# Altium schematic sheet MCU.SchDoc: STM32 microcontroller IOs
size 420 x 297 mm; CompanyName: STMicroelectronics; Organization: Microcontrollers Division; DocumentNumber: 16; SheetNumber: 17; SheetTotal: 17
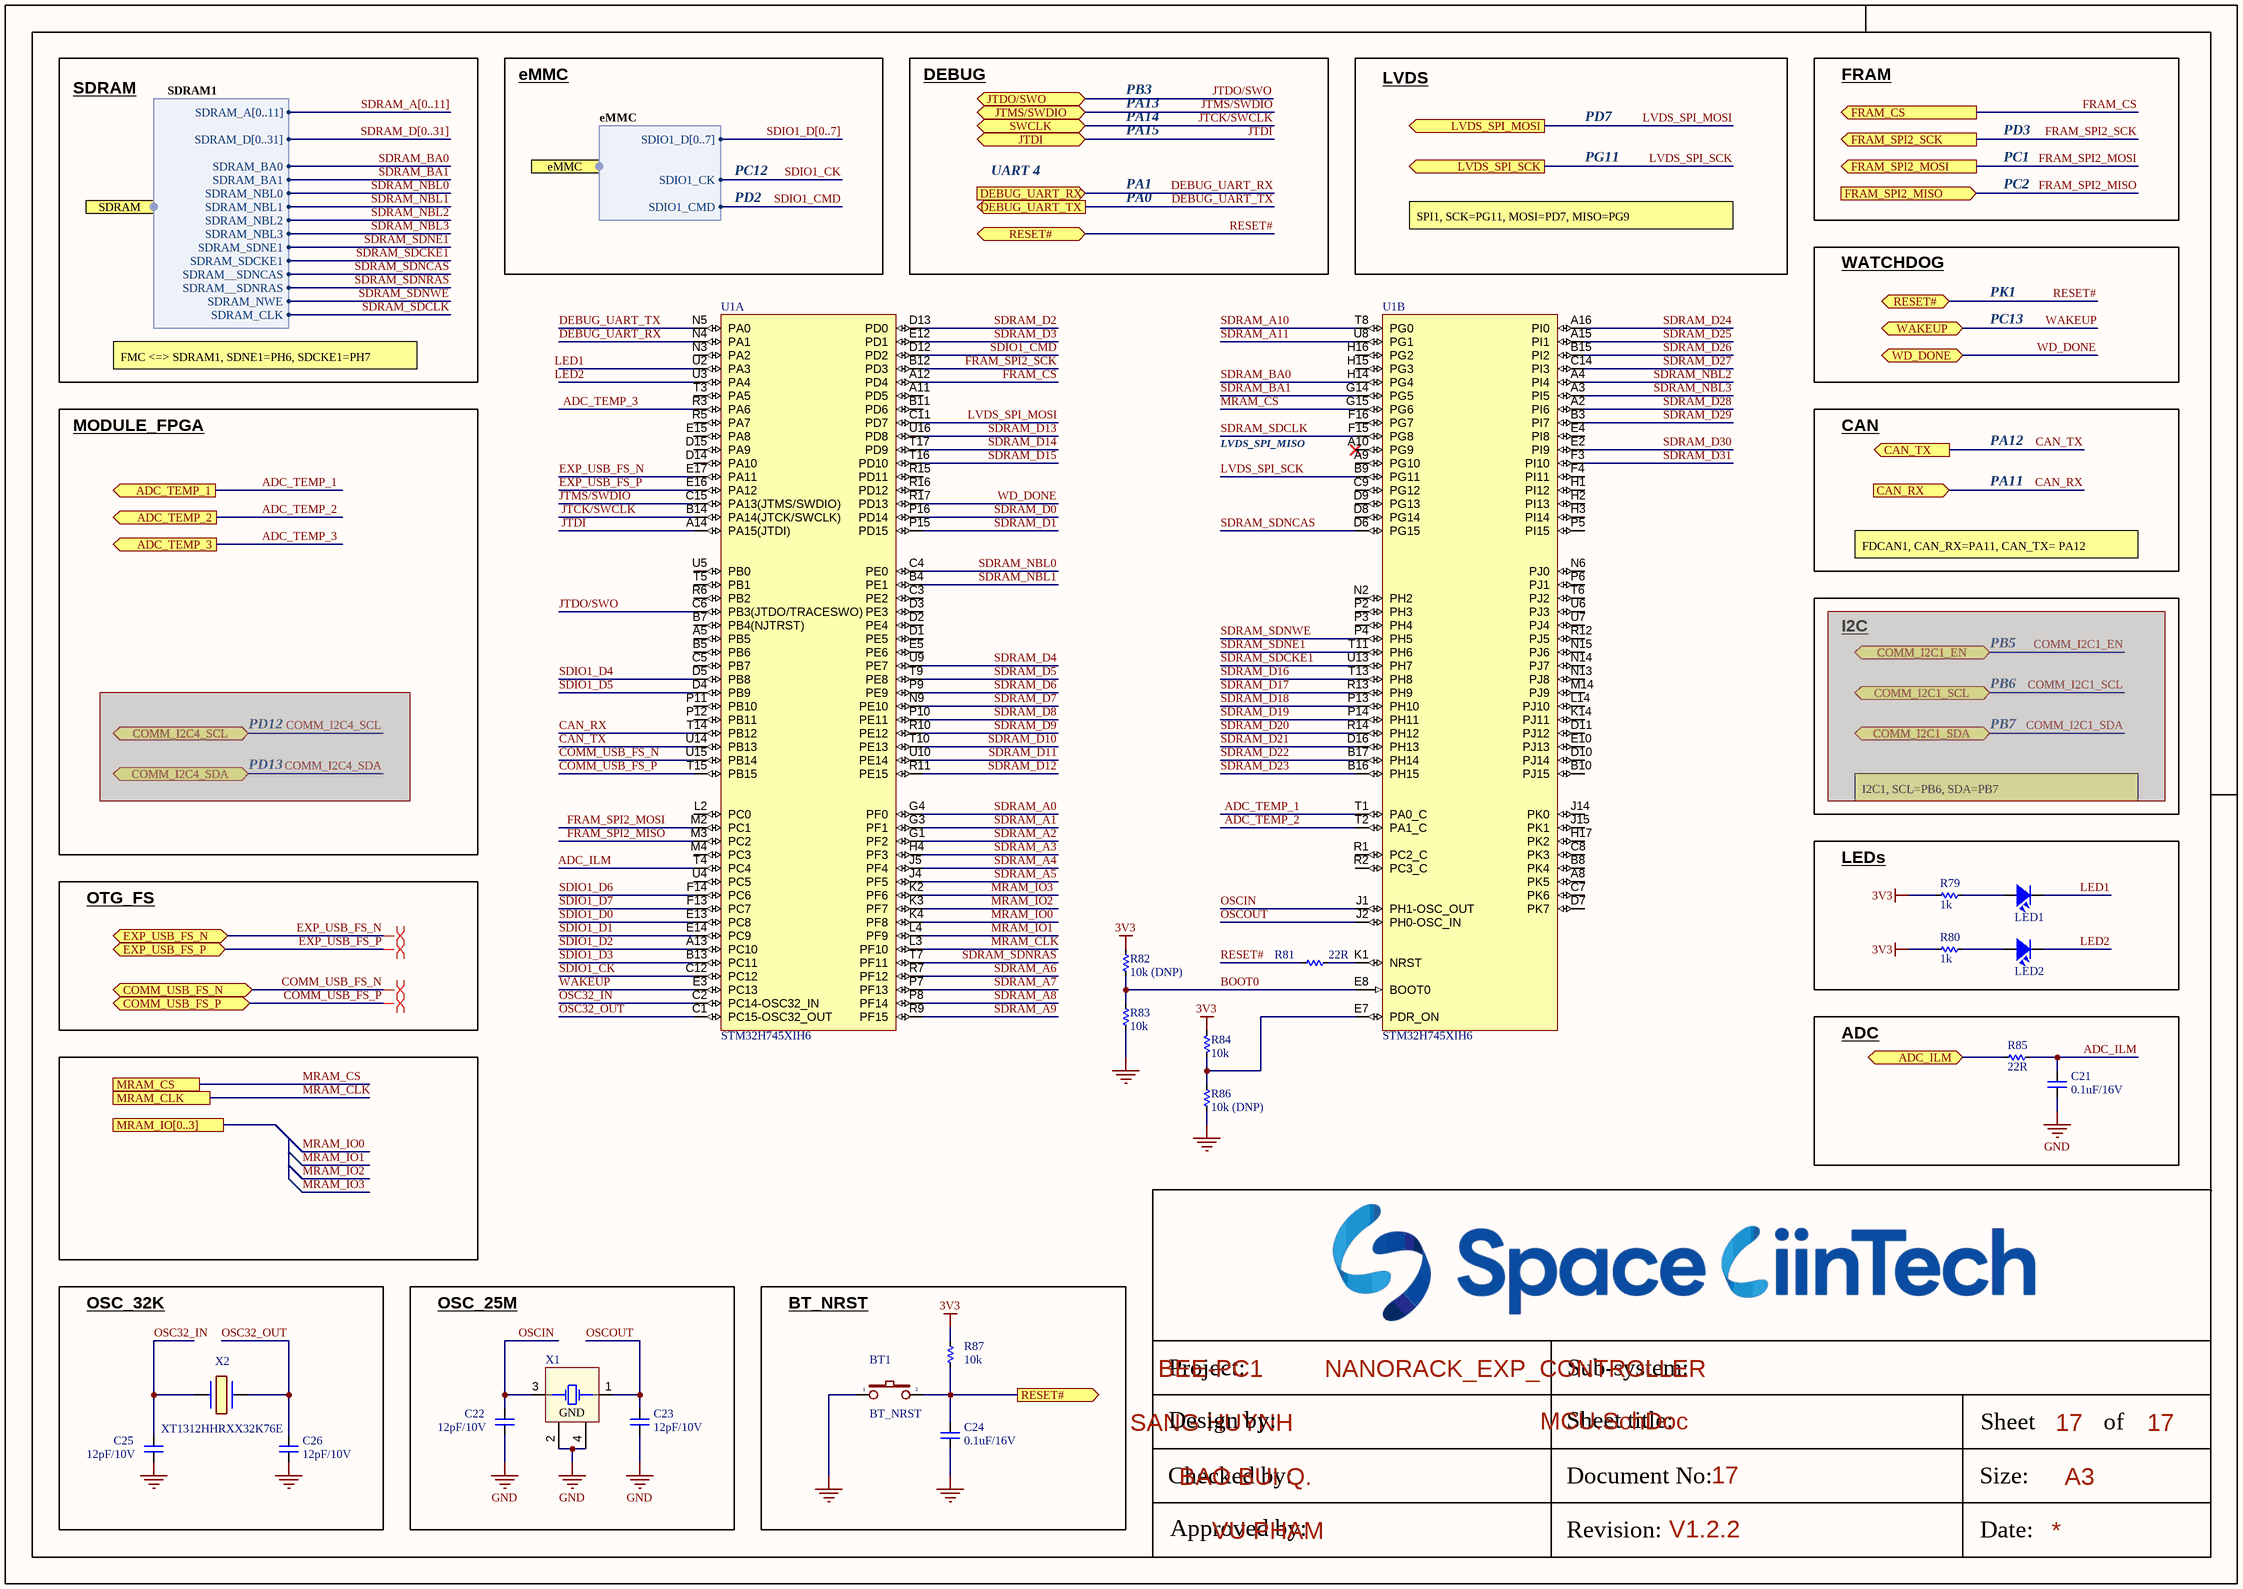
[diagram p0: MCU.SchDoc]

## Parts
BT1  BT_NRST  [SW2-SMD]
C21  0.1uF/16V  [CAP_C_1608X80]
C22  12pF/10V  [CAP_C_1608X80]
C23  12pF/10V  [CAP_C_1608X80]
C24  0.1uF/16V  [CAP_C_1608X80]
C25  12pF/10V  [CAP_C_1608X80]
C26  12pF/10V  [CAP_C_1608X80]
LED1  150060BS75000  [LED_0603]  (value not drawn)
LED2  150060GS75000  [LED_0603]  (value not drawn)
R79  1k  [RES_C_1608X60]
R80  1k  [RES_C_1608X60]
R81  22R  [RES_C_1608X60]
R82  10k (DNP)  [RES_C_1608X60]
R83  10k  [RES_C_1608X60]
R84  10k  [RES_C_1608X60]
R85  22R  [RES_C_1608X60]
R86  10k (DNP)  [RES_C_1608X60]
R87  10k  [RES_C_1608X60]
U1  STM32H745XIH6  [BGA265C80P17X17_1400X1400X110N]  (parts A,B of 3)
X1  ECS-250-12-33Q-JES-TR  [XTAL_ECS-250-12-33Q-JES-TR]  (value not drawn)
X2  XT1312HHRXX32K76E  [XT1312HHRXX32K76E]

## Blocks framed on the sheet
LEDs: LED1 LED2 R79 R80
ADC: C21 R85
OSC_32K: C25 C26 X2
OSC_25M: C22 C23 X1
BT_NRST: BT1 C24 R87

## Ports
ADC_ILM (bidir), ADC_TEMP_1 (out), ADC_TEMP_2 (out), ADC_TEMP_3 (out), CAN_RX (in), CAN_TX (out), COMM_I2C1_EN (bidir), COMM_I2C1_SCL (bidir), COMM_I2C1_SDA (bidir), COMM_I2C4_SCL (bidir), COMM_I2C4_SDA (bidir), COMM_USB_FS_N (bidir), COMM_USB_FS_P (bidir), DEBUG_UART_RX (in), DEBUG_UART_TX (out), eMMC (harness eMMC), EXP_USB_FS_N (bidir), EXP_USB_FS_P (bidir), FRAM_CS (out), FRAM_SPI2_MISO (in), FRAM_SPI2_MOSI (out), FRAM_SPI2_SCK (out), JTDI (bidir), JTDO/SWO (bidir), JTMS/SWDIO (bidir), LVDS_SPI_MOSI (out), LVDS_SPI_SCK (out), MRAM_CLK, MRAM_CS, MRAM_IO[0..3], RESET# (bidir), RESET# (out), SDRAM (harness SDRAM1), SWCLK (bidir), WAKEUP (bidir), WD_DONE (bidir)

## Harnesses
SDRAM1: SDRAM_A[0..11], SDRAM__SDNCAS, SDRAM_NBL0, SDRAM_SDNE1, SDRAM_SDCKE1, SDRAM_D[0..31], SDRAM_NBL1, SDRAM_BA0, SDRAM_BA1, SDRAM_NWE, SDRAM_CLK, SDRAM__SDNRAS, SDRAM_NBL3, SDRAM_NBL2
eMMC: SDIO1_D[0..7], SDIO1_CMD, SDIO1_CK

## Nets
3V3: R79.1 R80.1 R82.1 R84.1 R87.1
GND: BT1.1 C21.1 C22.1 C23.1 C24.1 C25.1 C26.1 R83.2 R86.2 X1.2(GND) X1.4(GND)
ADC_ILM: R85.1 ; port ADC_ILM
ADC_ILM: C21.2 R85.2 U1.T4(PC4)  [a separate net that carries the same name]
ADC_TEMP_1: U1.T1(PA0_C) ; port ADC_TEMP_1
ADC_TEMP_2: U1.T2(PA1_C) ; port ADC_TEMP_2
ADC_TEMP_3: U1.R3(PA6) ; port ADC_TEMP_3
BOOT0: R82.2 R83.1 U1.E8(BOOT0)
CAN_RX: U1.T14(PB12) ; port CAN_RX
CAN_TX: U1.U14(PB13) ; port CAN_TX
COMM_USB_FS_N: U1.U15(PB14) ; port COMM_USB_FS_N
COMM_USB_FS_P: U1.T15(PB15) ; port COMM_USB_FS_P
DEBUG_UART_RX: U1.N4(PA1) ; port DEBUG_UART_RX
DEBUG_UART_TX: U1.N5(PA0) ; port DEBUG_UART_TX
EXP_USB_FS_N: U1.E17(PA11) ; port EXP_USB_FS_N
EXP_USB_FS_P: U1.E16(PA12) ; port EXP_USB_FS_P
FRAM_CS: U1.A12(PD4) ; port FRAM_CS
FRAM_SPI2_MISO: U1.M3(PC2) ; port FRAM_SPI2_MISO
FRAM_SPI2_MOSI: U1.M2(PC1) ; port FRAM_SPI2_MOSI
FRAM_SPI2_SCK: U1.B12(PD3) ; port FRAM_SPI2_SCK
JTCK/SWCLK: U1.B14(PA14(JTCK/SWCLK)) ; port SWCLK
JTDI: U1.A14(PA15(JTDI)) ; port JTDI
JTDO/SWO: U1.C6(PB3(JTDO/TRACESWO)) ; port JTDO/SWO
JTMS/SWDIO: U1.C15(PA13(JTMS/SWDIO)) ; port JTMS/SWDIO
LED1: LED1.2 U1.U2(PA3)
LED2: LED2.2 U1.U3(PA4)
LVDS_SPI_MOSI: U1.C11(PD7) ; port LVDS_SPI_MOSI
LVDS_SPI_SCK: U1.B9(PG11) ; port LVDS_SPI_SCK
MRAM_CLK: U1.L3(PF10) ; port MRAM_CLK
MRAM_CS: U1.G15(PG6) ; port MRAM_CS
MRAM_IO0: U1.K4(PF8)
MRAM_IO1: U1.L4(PF9)
MRAM_IO2: U1.K3(PF7)
MRAM_IO3: U1.K2(PF6)
OSC32_IN: C25.2 U1.C2(PC14-OSC32_IN) X2.1
OSC32_OUT: C26.2 U1.C1(PC15-OSC32_OUT) X2.2
OSCIN: C22.2 U1.J1(PH1-OSC_OUT) X1.3(XTAL)
OSCOUT: C23.2 U1.J2(PH0-OSC_IN) X1.1(XTAL)
RESET#: BT1.2 C24.2 R81.1 R87.2 ; port RESET#
SDIO1_CK: U1.C12(PC12) ; port eMMC.SDIO1_CK
SDIO1_CMD: U1.D12(PD2) ; port eMMC.SDIO1_CMD
SDIO1_D0: U1.E13(PC8)
SDIO1_D1: U1.E14(PC9)
SDIO1_D2: U1.A13(PC10)
SDIO1_D3: U1.B13(PC11)
SDIO1_D4: U1.D5(PB8)
SDIO1_D5: U1.D4(PB9)
SDIO1_D6: U1.F14(PC6)
SDIO1_D7: U1.F13(PC7)
SDRAM_A0: U1.G4(PF0)
SDRAM_A1: U1.G3(PF1)
SDRAM_A2: U1.G1(PF2)
SDRAM_A3: U1.H4(PF3)
SDRAM_A4: U1.J5(PF4)
SDRAM_A5: U1.J4(PF5)
SDRAM_A6: U1.R7(PF12)
SDRAM_A7: U1.P7(PF13)
SDRAM_A8: U1.P8(PF14)
SDRAM_A9: U1.R9(PF15)
SDRAM_A10: U1.T8(PG0)
SDRAM_A11: U1.U8(PG1)
SDRAM_BA0: U1.H14(PG4) ; port SDRAM.SDRAM_BA0
SDRAM_BA1: U1.G14(PG5) ; port SDRAM.SDRAM_BA1
SDRAM_D0: U1.P16(PD14)
SDRAM_D1: U1.P15(PD15)
SDRAM_D2: U1.D13(PD0)
SDRAM_D3: U1.E12(PD1)
SDRAM_D4: U1.U9(PE7)
SDRAM_D5: U1.T9(PE8)
SDRAM_D6: U1.P9(PE9)
SDRAM_D7: U1.N9(PE10)
SDRAM_D8: U1.P10(PE11)
SDRAM_D9: U1.R10(PE12)
SDRAM_D10: U1.T10(PE13)
SDRAM_D11: U1.U10(PE14)
SDRAM_D12: U1.R11(PE15)
SDRAM_D13: U1.U16(PD8)
SDRAM_D14: U1.T17(PD9)
SDRAM_D15: U1.T16(PD10)
SDRAM_D16: U1.T13(PH8)
SDRAM_D17: U1.R13(PH9)
SDRAM_D18: U1.P13(PH10)
SDRAM_D19: U1.P14(PH11)
SDRAM_D20: U1.R14(PH12)
SDRAM_D21: U1.D16(PH13)
SDRAM_D22: U1.B17(PH14)
SDRAM_D23: U1.B16(PH15)
SDRAM_D24: U1.A16(PI0)
SDRAM_D25: U1.A15(PI1)
SDRAM_D26: U1.B15(PI2)
SDRAM_D27: U1.C14(PI3)
SDRAM_D28: U1.A2(PI6)
SDRAM_D29: U1.B3(PI7)
SDRAM_D30: U1.E2(PI9)
SDRAM_D31: U1.F3(PI10)
SDRAM_NBL0: U1.C4(PE0) ; port SDRAM.SDRAM_NBL0
SDRAM_NBL1: U1.B4(PE1) ; port SDRAM.SDRAM_NBL1
SDRAM_NBL2: U1.A4(PI4) ; port SDRAM.SDRAM_NBL2
SDRAM_NBL3: U1.A3(PI5) ; port SDRAM.SDRAM_NBL3
SDRAM_SDCKE1: U1.U13(PH7) ; port SDRAM.SDRAM_SDCKE1
SDRAM_SDCLK: U1.F15(PG8) ; port SDRAM.SDRAM_CLK
SDRAM_SDNCAS: U1.D6(PG15) ; port SDRAM.SDRAM__SDNCAS
SDRAM_SDNE1: U1.T11(PH6) ; port SDRAM.SDRAM_SDNE1
SDRAM_SDNRAS: U1.T7(PF11) ; port SDRAM.SDRAM__SDNRAS
SDRAM_SDNWE: U1.P4(PH5) ; port SDRAM.SDRAM_NWE
WAKEUP: U1.E3(PC13) ; port WAKEUP
WD_DONE: U1.R17(PD13) ; port WD_DONE
NetLED1_1: LED1.1 R79.2
NetLED2_1: LED2.1 R80.2
NetR81_2: R81.2 U1.K1(NRST)
NetR84_2: R84.2 R86.1 U1.E7(PDR_ON)

Not connected (* = marked no-connect by the designer): U1 A5(PB5) A8(PK5) A9(PG10) A10(PG9)* A11(PD5) B5(PB6) B7(PB4(NJTRST)) B8(PK4) B10(PJ15) B11(PD6) C3(PE2) C5(PB7) C7(PK6) C8(PK3) C9(PG12) D1(PE5) D2(PE4) D3(PE3) D7(PK7) D8(PG14) D9(PG13) D10(PJ14) D11(PJ12) D14(PA10) D15(PA9) E4(PI8) E5(PE6) E10(PJ13) E15(PA8) F4(PI11) F16(PG7) H1(PI12) H2(PI13) H3(PI14) H15(PG3) H16(PG2) H17(PK2) J14(PK0) J15(PK1) K14(PJ11) L2(PC0) L14(PJ10) M4(PC3) M14(PJ9) N2(PH2) N3(PA2) N6(PJ0) N13(PJ8) N14(PJ7) N15(PJ6) P2(PH3) P3(PH4) P5(PI15) P6(PJ1) P11(PB10) P12(PB11) R1(PC2_C) R2(PC3_C) R5(PA7) R6(PB2) R12(PJ5) R15(PD11) R16(PD12) T3(PA5) T5(PB1) T6(PJ2) U4(PC5) U5(PB0) U6(PJ3) U7(PJ4)

## Buses and harness runs
bus SDIO1_D[0..7]
bus SDRAM_A[0..11]
bus SDRAM_D[0..31]

## Layout directives
differential pair: COMM_USB_FS_N, COMM_USB_FS_P, EXP_USB_FS_N, EXP_USB_FS_P

## Notes on the sheet
- SDRAM
- eMMC
- DEBUG
- PB3
- PA13
- PA14
- LVDS
- PD7
- FRAM
- PC12
- UART 4
- PA15
- PA1
- PG11
- PC1
- PC2
- PD3
- PD2
- PA0
- SPI1, SCK=PG11, MOSI=PD7, MISO=PG9
- WATCHDOG
- PK1
- PC13
- FMC <=> SDRAM1, SDNE1=PH6, SDCKE1=PH7
- MODULE_FPGA
- LVDS_SPI_MISO
- CAN
- PA12
- PA11
- FDCAN1, CAN_RX=PA11, CAN_TX= PA12
- I2C
- PB5
- PD12
- PB6
- PB7
- PD13
- I2C1, SCL=PB6, SDA=PB7
- OTG_FS
- Project:
- BEE-PC1
- Sub-system:
- NANORACK_EXP_CONTROLLER
- Design by:
- SANG HUYNH
- BAO BUI Q.
- Sheet title:
- Sheet
- A3
- of
- Checked by:
- Approved by:
- VU PHAM
- Revision:
- Document No:
- V1.2.2
- Size:
- Date:

## Library data of the parts
BT1 = BT2: Switch button 2 pin; Value: SW chip 2 pin
C21-C26 = CAP_SMD: CAP_Chip; Value: 33pF
LED1 LED2 = LED SMD: Value: LED 3 - 5 ly 2 Colour
R79-R87 = _RES_B_2: RES
U1 = STM32H745XIH6: High-performance and DSP with DP-FPU, Arm Cortex-M7 + Cortex-M4 MCU with 2MBytes of Flash memory, 1MB RAM, 480 MHz CPU, Art Accelerator, L1 cache, external memory interface, large set of peripherals, SMPS; Manufacturer_Name: STMicroelectronics; Copyright: Copyright (C) 2025 Ultra Librarian. All rights reserved.; Manufacturer_Part_Number: STM32H745XIH6; Datasheet: https://www.st.com/resource/en/datasheet/stm32h745zg.pdf; RefDes: RefDes; Type: Type
X1 = XT4: Crystal, 25 MHz, -30 to 85 degC, 3.2 x 2.5 x 0.9 mm SMD; Value: 4Mhz
X2 = XT1312HHRXX32K76E: 32.768 kHz +/-20ppm Crystal 12pF 70 kOhms 2-SMD, No Lead , -40C ~ 85C; Manufacturer_Name: Vishay; Geometry.Height: 0.8mm; Mouser Part Number: 70-XT1312HHRXX32K76E; Mouser Price/Stock: https://www.mouser.co.uk/ProductDetail/Vishay-Dale/XT1312HHRXX32K76E?qs=jcD%2FCkGBYeMqyUz9UpSqCw%3D%3D; Arrow Part Number: *; Arrow Price/Stock: *; Datasheet Link: https://www.vishay.com/docs/35071/xt13.pdf; Manufacturer_Part_Number: XT1312HHRXX32K76E